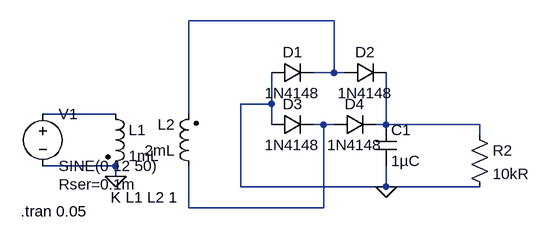
[diagram p0: schematic full_wave_rectifier_with_C.asc]
full_wave_rectifier_with_C.asc, the LTspice schematic file:
Version 4
SHEET 1 880 680
WIRE 256 0 32 0
WIRE 256 80 256 0
WIRE 256 80 224 80
WIRE 272 80 256 80
WIRE 160 128 160 80
WIRE 160 128 112 128
WIRE -80 144 -192 144
WIRE 32 144 32 0
WIRE 160 160 160 128
WIRE 240 160 224 160
WIRE 256 160 240 160
WIRE 336 160 336 80
WIRE 336 160 320 160
WIRE 480 160 336 160
WIRE 480 176 480 160
WIRE -80 224 -192 224
WIRE -80 240 -80 224
WIRE 112 256 112 128
WIRE 336 256 336 224
WIRE 336 256 112 256
WIRE 480 256 336 256
WIRE 32 288 32 224
WIRE 240 288 240 160
WIRE 240 288 32 288
FLAG 336 256 0
FLAG -80 240 0
SYMBOL diode 160 96 R270
WINDOW 0 32 32 VTop 2
WINDOW 3 0 32 VBottom 2
SYMATTR InstName D1
SYMATTR Value 1N4148
SYMBOL diode 272 96 R270
WINDOW 0 32 32 VTop 2
WINDOW 3 0 32 VBottom 2
SYMATTR InstName D2
SYMATTR Value 1N4148
SYMBOL diode 160 176 R270
WINDOW 0 32 32 VTop 2
WINDOW 3 0 32 VBottom 2
SYMATTR InstName D3
SYMATTR Value 1N4148
SYMBOL diode 256 176 R270
WINDOW 0 32 32 VTop 2
WINDOW 3 0 32 VBottom 2
SYMATTR InstName D4
SYMATTR Value 1N4148
SYMBOL ind2 -96 128 R0
SYMATTR InstName L1
SYMATTR Value 1mL
SYMATTR Type ind
SYMBOL voltage -192 128 R0
WINDOW 123 0 0 Left 0
WINDOW 39 24 124 Left 2
SYMATTR InstName V1
SYMATTR Value SINE(0 12 50)
SYMATTR SpiceLine Rser=0.1m
SYMBOL ind2 48 240 R180
WINDOW 0 36 80 Left 2
WINDOW 3 36 40 Left 2
SYMATTR InstName L2
SYMATTR Value 2mL
SYMATTR Type ind
SYMBOL cap 320 160 R0
SYMATTR InstName C1
SYMATTR Value 1µC
SYMBOL res 464 160 R0
SYMATTR InstName R2
SYMATTR Value 10kR
TEXT -88 272 Left 2 !K L1 L2 1
TEXT -226 294 Left 2 !.tran 0.05

The netlist it stands for:
* full_wave_rectifier_with_C.asc
D1 0 N001 1N4148
D2 N001 N004 1N4148
D3 0 N003 1N4148
D4 N003 N004 1N4148
L1 N002 0 1mL
V1 N002 0 SINE(0 12 50) Rser=0.1m
L2 N003 N001 2mL
C1 N004 0 1µC
R2 N004 0 10kR
.model D D
.lib standard.dio
K L1 L2 1
.tran 0.05
.backanno
.end